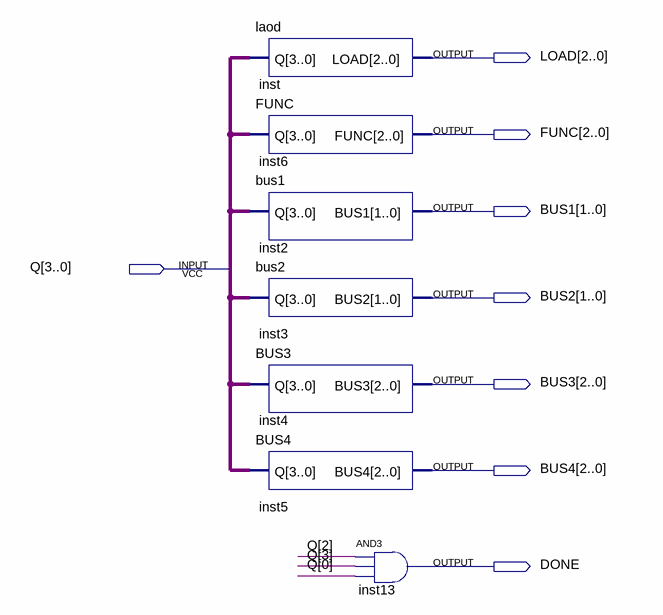
[diagram p0: schematic sheet]
// Quartus schematic OUTPUTLOGIC.bdf as structural Verilog: 7 symbols, 8 pins
module OUTPUTLOGIC (
  input  [3:0] Q,
  output [2:0] LOAD,
  output [2:0] FUNC,
  output [1:0] BUS1,
  output [1:0] BUS2,
  output [2:0] BUS3,
  output [2:0] BUS4,
  output DONE
);

  laod inst (.Q(Q), .LOAD(LOAD));
  FUNC inst6 (.Q(Q), .FUNC(FUNC));
  bus1 inst2 (.Q(Q), .BUS1(BUS1));
  bus2 inst3 (.Q(Q), .BUS2(BUS2));
  BUS3 inst4 (.Q(Q), .BUS3(BUS3));
  BUS4 inst5 (.Q(Q), .BUS4(BUS4));
  and inst13 (DONE, Q[2], Q[3], Q[0]);
endmodule
